# Altium schematic sheet Sheet1.SchDoc
size A; SheetNumber: 1; SheetTotal: 1
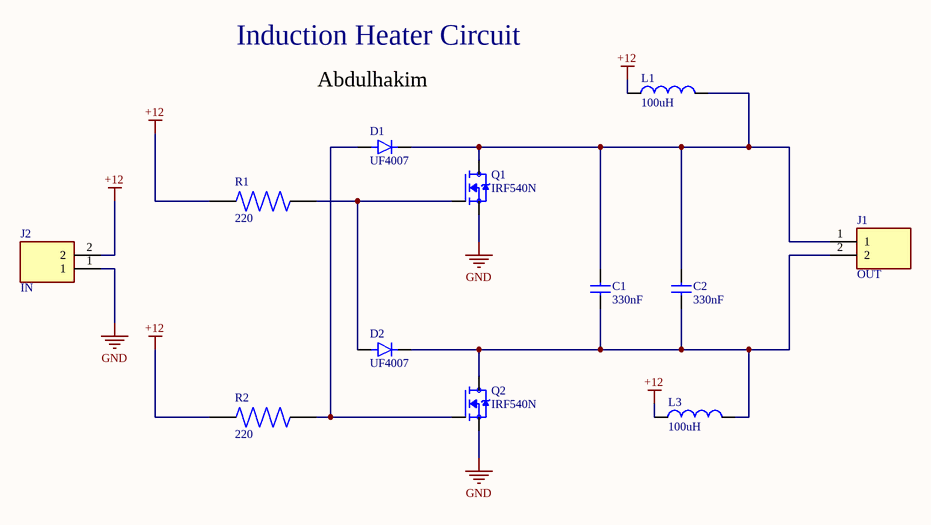
[diagram p0: Sheet1.SchDoc]

## Parts
C1  330nF  [WCAP-FTX2_P15L18W8.5H14.5_CS]
C2  330nF  [WCAP-FTX2_P15L18W8.5H14.5_CS]
D1  UF4007  [DIOAD1036W78L470D235]
D2  UF4007  [DIOAD1036W78L470D235]
J1  OUT  [CUI_TB007-508-02BE]
J2  IN  [CUI_TB007-508-02BE]
L1  100uH  [WE-SI_744132]
L3  100uH  [WE-SI_744132]
Q1  IRF540N  [TO254P1054X469X1930-3]
Q2  IRF540N  [TO254P1054X469X1930-3]
R1  220  [RESC6331X75N]
R2  220  [RESC6331X75N]

## Nets
+12: J2.2 L1.1 L3.1 R1.1 R2.1
GND: J2.1 Q1.3(S) Q2.3(S)
NetC1_1: C1.1 C2.1 D2.C(K) J1.2 L3.2 Q2.2(D)
NetC1_2: C1.2 C2.2 D1.C(K) J1.1 L1.2 Q1.2(D)
NetD1_A: D1.A Q2.1(G) R2.2
NetD2_A: D2.A Q1.1(G) R1.2

## Notes on the sheet
- Induction Heater Circuit
- Abdulhakim

## Library data of the parts
C1 C2 = WCAP-FTX2_P15_CS: WCAP-FTX2 Film Capacitor 330nF 275Vac ¦ Wurth Electronics 890324025034CS; MF: WÃ¼rth Elektronik; SnapEDA_Link: https://www.snapeda.com/parts/890324025034CS/W%25C3%25BCrth+Elektronik+Midcom/view-part/?ref=snap; Package: Radial WÃ¼rth Elektronik; Value: *; MP: 890324025034CS; Check_prices: https://www.snapeda.com/parts/890324025034CS/W%25C3%25BCrth+Elektronik+Midcom/view-part/?ref=eda
D1 D2 = UF4007: UF4007 Series 1 A 1000 V 75 ns Through Hole Fast Rectifier - DO-41; MF: Fairchild Semiconductor; MP: UF4007.; SnapEDA_Link: https://www.snapeda.com/parts/UF4007./Onsemi/view-part/?ref=snap; Package: DO-41 Fairchild Semiconductor; Value: *; Check_prices: https://www.snapeda.com/parts/UF4007./Onsemi/view-part/?ref=eda
J1 J2 = TB007-508-02BE: 2~24 Poles, Screw Type, Horizontal, 5.08 Pitch, 24~12 (AWG), Terminal Block Connector; MF: Same Sky; SnapEDA_Link: https://www.snapeda.com/parts/TB007-508-02BE/Same+Sky/view-part/?ref=snap; Package: None; Value: *; MP: TB007-508-02BE; Check_prices: https://www.snapeda.com/parts/TB007-508-02BE/Same+Sky/view-part/?ref=eda
L1 L3 = WE-SI: L = 49 ÂµH ; IR = 5.8 A; Isat = 2.2 A; RDC = 0.05 â„¦; MF: Wurth Elektronik; MP: 744132; SnapEDA_Link: https://www.snapeda.com/parts/744132/Wurth+Electronics/view-part/?ref=snap; Package: None; Value: *; Check_prices: https://www.snapeda.com/parts/744132/Wurth+Electronics/view-part/?ref=eda
Q1 Q2 = IRF540N: Transistor NPN MOS IRF540/IRF540N INTERNATIONAL RECTIFIER Ampere=28 V=100 TO220; MF: Infineon Technologies; SnapEDA_Link: https://www.snapeda.com/parts/IRF540N/Infineon/view-part/?ref=snap; Package: Package; Value: *; MP: IRF540N; Check_prices: https://www.snapeda.com/parts/IRF540N/Infineon/view-part/?ref=eda
R1 R2 = CR2512-JW-221ELF: PelÃ­cula gruesa de resina 2512, 220 ohmios, 5 % 1 W, Â±200 ppm/Â°C, SMD moldeado, SMD, plÃ¡stico en relieve, T/R; MF: Bourns; SnapEDA_Link: https://www.snapeda.com/parts/CR2512-JW-221ELF/Bourns/view-part/?ref=snap; Package: 6331 Bourns; Value: *; MP: CR2512-JW-221ELF; Check_prices: https://www.snapeda.com/parts/CR2512-JW-221ELF/Bourns/view-part/?ref=eda